# Altium schematic sheet SPI LVDS Slave.SchDoc: SPI Low Voltage Differential Signaling (LVDS) Breakout Board
size 431 x 279 mm; Organization: TESLA Motors, INC; Address1: 3500 Deer Creek Road; Address2: Palo Alto, CA; Address4: U.S.A.; SheetNumber: 1; SheetTotal: 1
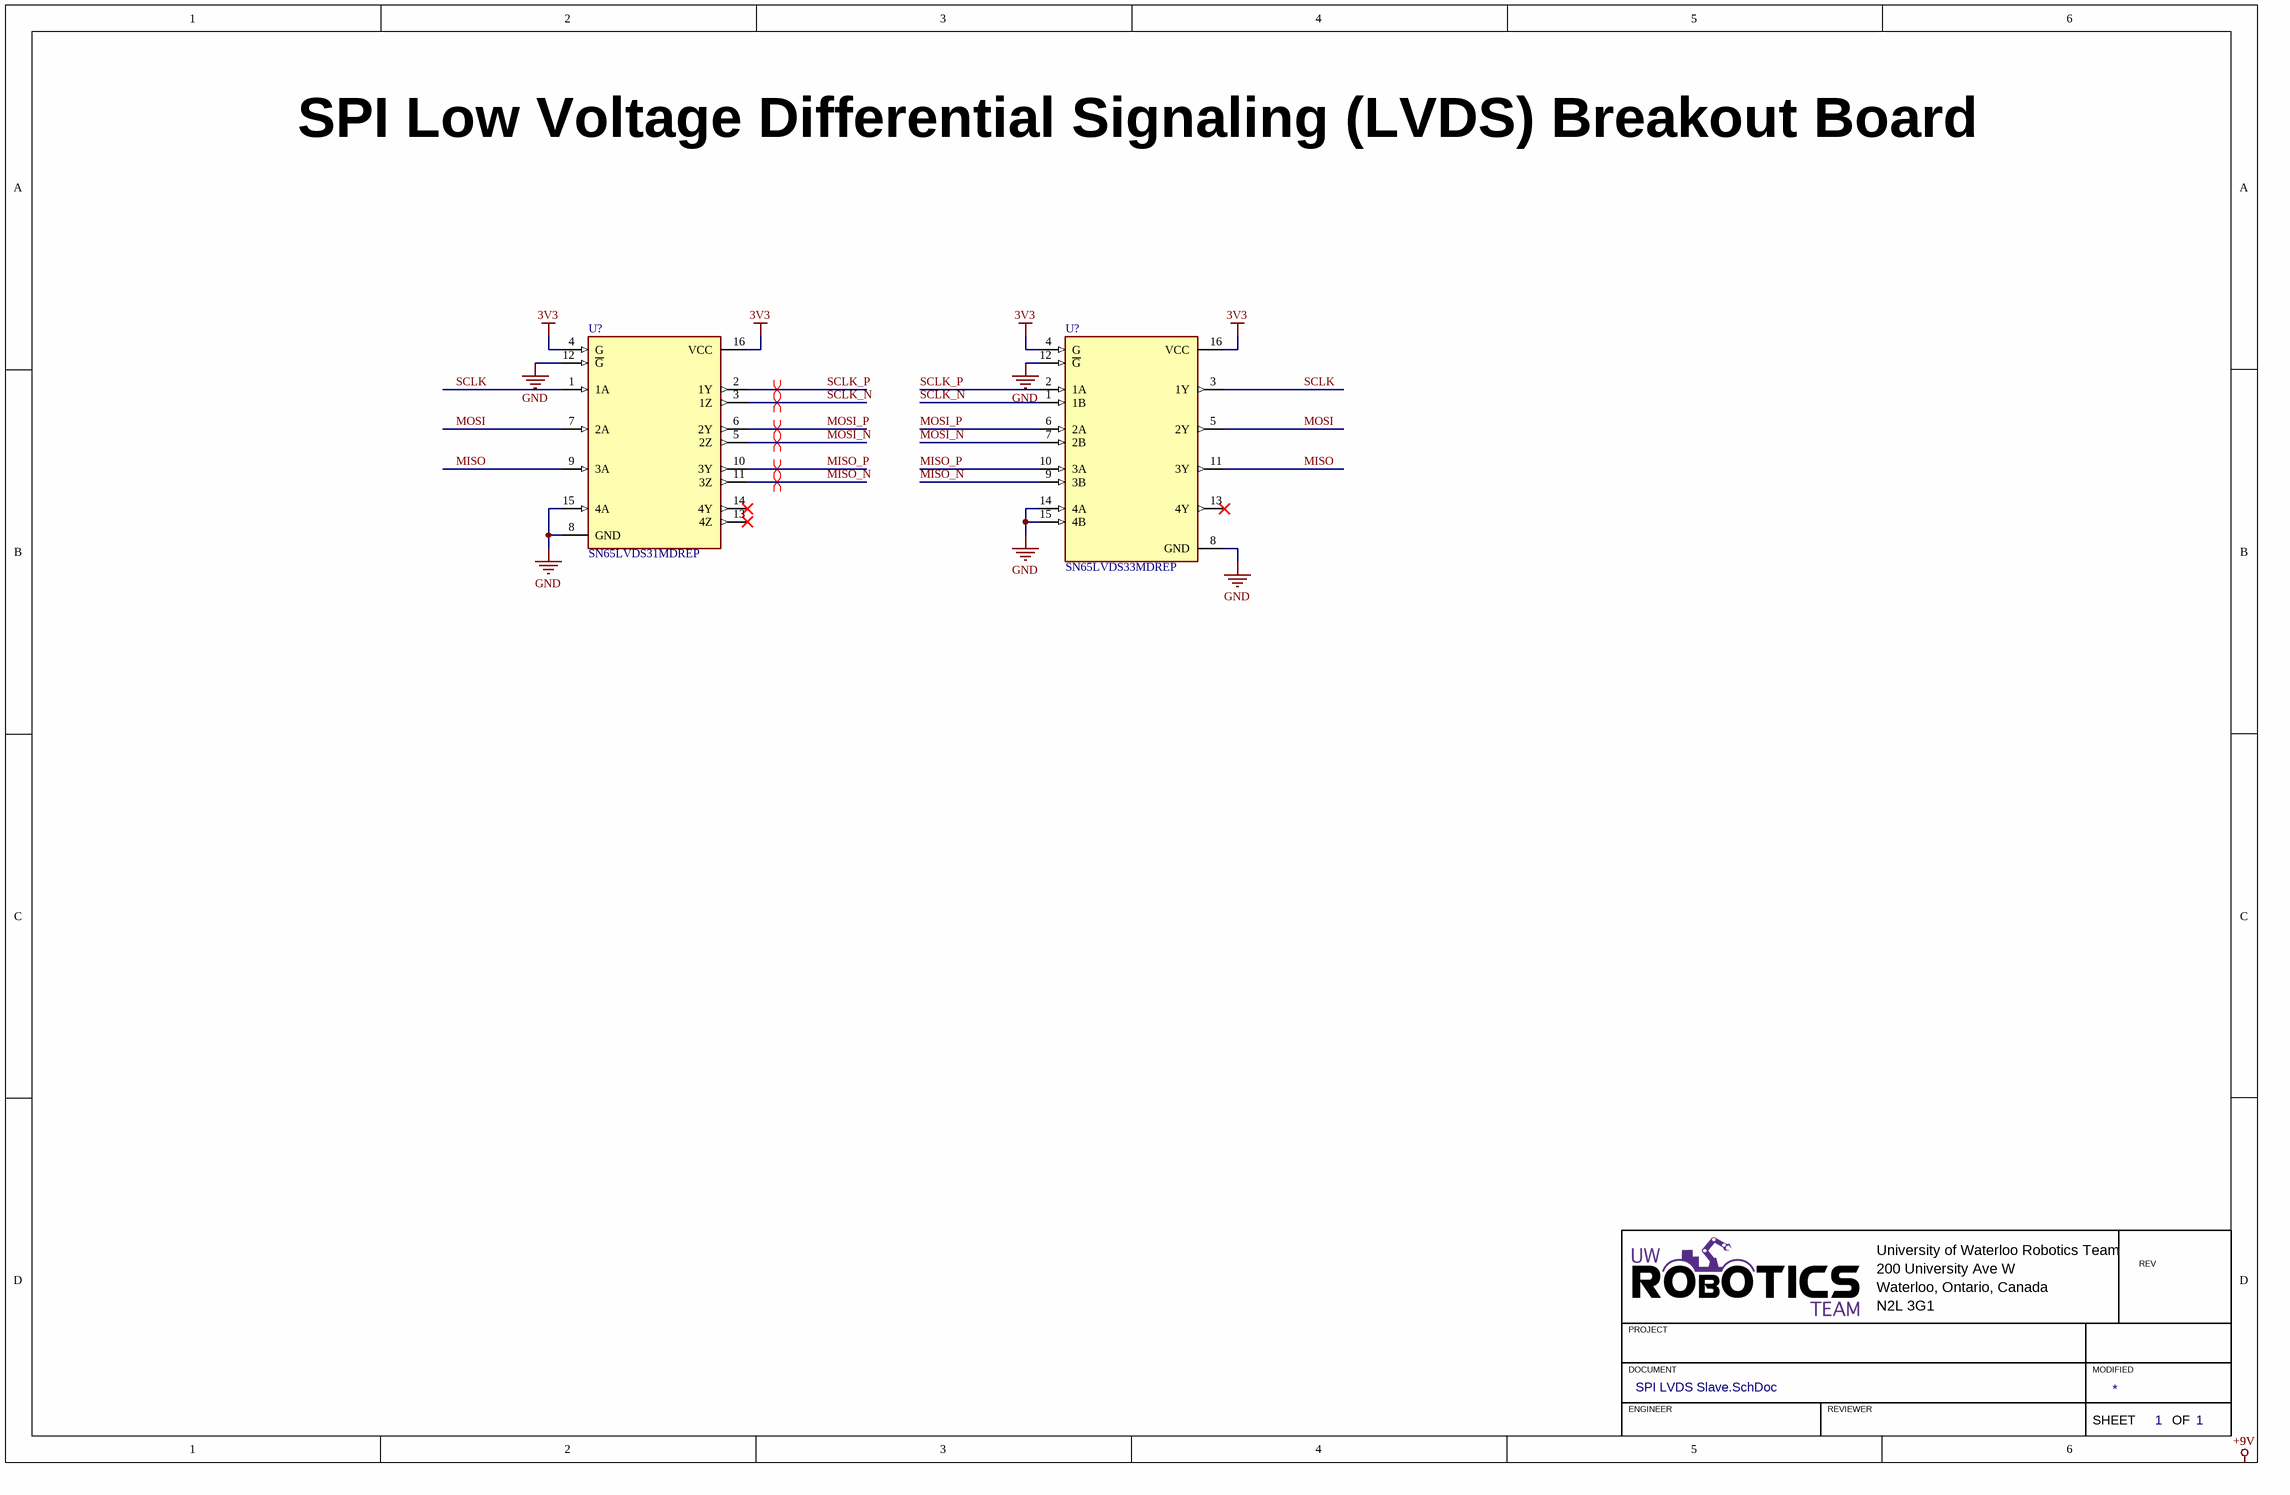
[diagram p0: SPI LVDS Slave.SchDoc]

## Parts
(Parts that share a designator on the sheet are numbered #1, #2 ... from top to bottom, then left to right.)
U?#1  SN65LVDS31MDREP  [SOIC127P600X175-16N]
U?#2  SN65LVDS33MDREP  [SOIC127P600X175-16N]

## Nets
3V3: U?#1.4(G) U?#1.16(VCC) U?#2.4(G) U?#2.16(VCC)
GND: U?#1.8(GND) U?#1.12(~{G}) U?#1.15(4A) U?#2.8(GND) U?#2.12(~{G}) U?#2.14(4A) U?#2.15(4B)
MISO: U?#1.9(3A) U?#2.11(3Y)
MISO_N: U?#1.11(3Z) U?#2.9(3B)
MISO_P: U?#1.10(3Y) U?#2.10(3A)
MOSI: U?#1.7(2A) U?#2.5(2Y)
MOSI_N: U?#1.5(2Z) U?#2.7(2B)
MOSI_P: U?#1.6(2Y) U?#2.6(2A)
SCLK: U?#1.1(1A) U?#2.3(1Y)
SCLK_N: U?#1.3(1Z) U?#2.1(1B)
SCLK_P: U?#1.2(1Y) U?#2.2(1A)

Not connected (* = marked no-connect by the designer): U?#1 13(4Z)* 14(4Y)*; U?#2 13(4Y)*

## Layout directives
differential pair: MISO_N, MISO_P, MOSI_N, MOSI_P, SCLK_N, SCLK_P

## Notes on the sheet
- University of Waterloo Robotics Team
- 200 University Ave W
- REV
- PROJECT
- Waterloo, Ontario, Canada
- N2L 3G1
- DOCUMENT
- ENGINEER
- REVIEWER
- MODIFIED
- SHEET
- OF

## Library data of the parts
U?#1 = SN65LVDS31MDREP: IC DRIVER 4/0 16SOIC; Package: None; Price: None; Value: *; MP: SN65LVDS31MDREP; Availability: Unavailable
U?#2 = SN65LVDS33MDREP: IC RECEIVER 0/4 16SOIC; Package: None; Price: None; Value: *; MP: SN65LVDS33MDREP; Availability: Unavailable